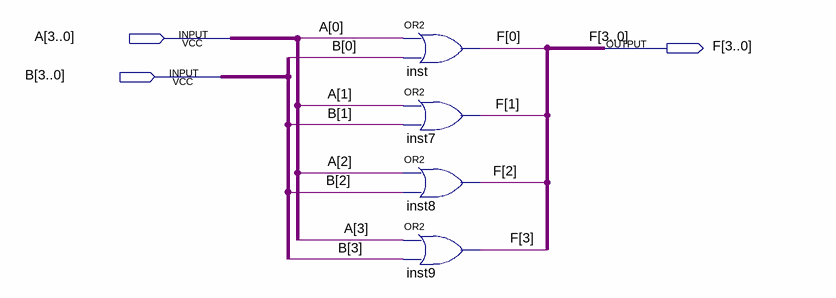
[diagram p0: schematic sheet]
// Quartus schematic 4b_or.bdf as structural Verilog: 4 symbols, 3 pins
module \4b_or  (
  input  [3:0] A,
  input  [3:0] B,
  output [3:0] F
);

  or inst (F[0], A[0], B[0]);
  or inst7 (F[1], A[1], B[1]);
  or inst8 (F[2], A[2], B[2]);
  or inst9 (F[3], A[3], B[3]);
endmodule
